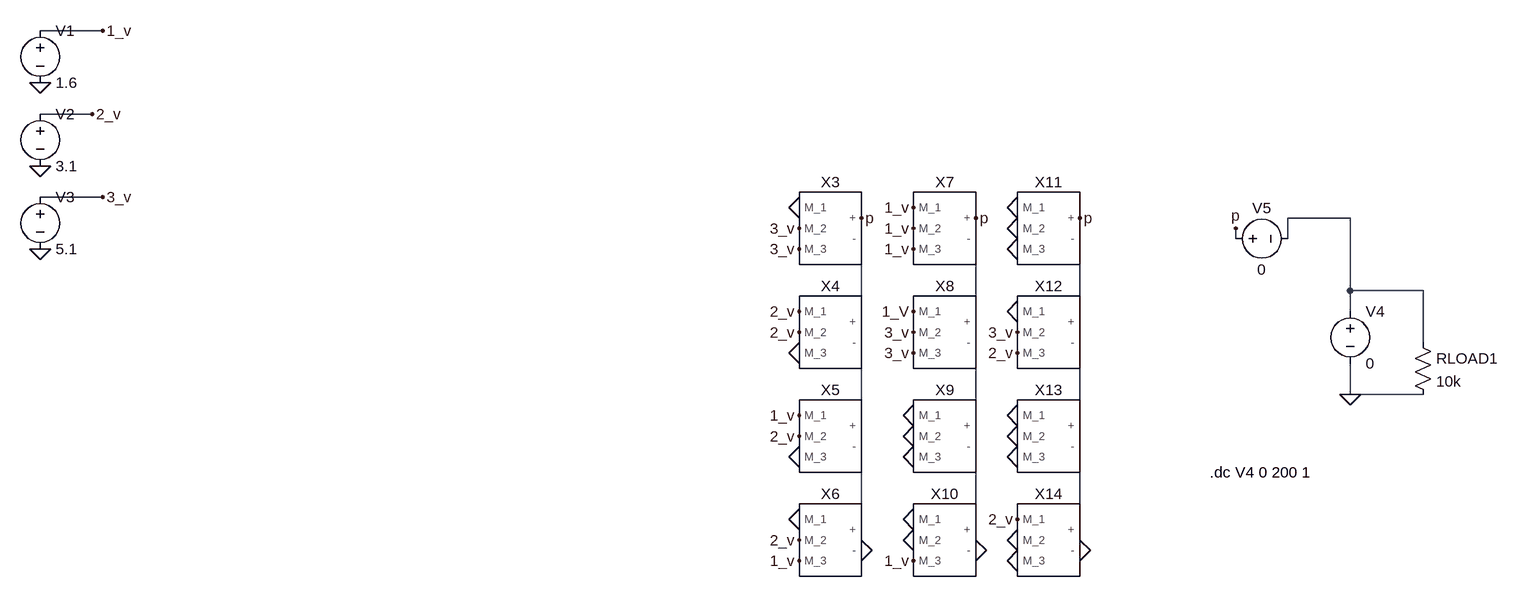
[diagram p0: schematic original.asc]
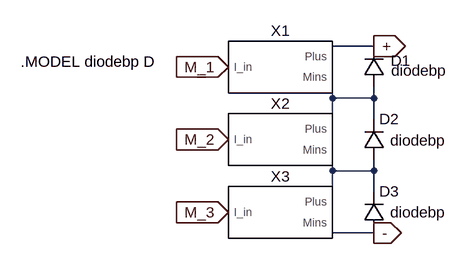
[diagram p1: sub-circuit pv_panel.asc]
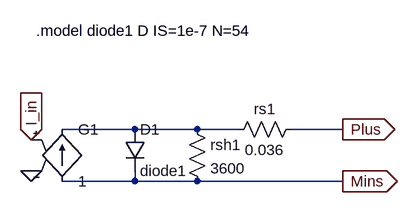
[diagram p2: sub-circuit module.asc]
original.asc, the LTspice schematic file:
Version 4
SHEET 1 1544 680
WIRE -608 -352 -704 -352
WIRE -624 -224 -704 -224
WIRE -608 -96 -704 -96
WIRE 1312 -64 1216 -64
WIRE 1136 -32 1136 -48
WIRE 1216 -32 1216 -64
WIRE 1312 48 1312 -64
WIRE 1424 48 1312 48
WIRE 1312 80 1312 48
WIRE 560 96 560 -32
WIRE 736 96 736 -32
WIRE 896 96 896 -32
WIRE 1424 128 1424 48
WIRE 1312 208 1312 160
WIRE 1424 208 1312 208
WIRE 560 256 560 128
WIRE 736 256 736 128
WIRE 896 256 896 128
WIRE 560 416 560 288
WIRE 736 416 736 288
WIRE 896 416 896 288
FLAG -704 -272 0
FLAG -704 -144 0
FLAG -704 -16 0
FLAG -608 -352 1_v
FLAG -624 -224 2_v
FLAG -608 -96 3_v
FLAG 896 448 0
FLAG 736 448 0
FLAG 560 448 0
FLAG 464 -48 3_v
FLAG 464 -16 3_v
FLAG 640 112 3_v
FLAG 640 144 3_v
FLAG 800 112 3_v
FLAG 640 -80 1_v
FLAG 640 -48 1_v
FLAG 640 -16 1_v
FLAG 464 240 1_v
FLAG 464 464 1_v
FLAG 640 464 1_v
FLAG 464 80 2_v
FLAG 464 112 2_v
FLAG 464 272 2_v
FLAG 464 432 2_v
FLAG 800 400 2_v
FLAG 800 144 2_v
FLAG 464 304 0
FLAG 464 144 0
FLAG 464 -80 0
FLAG 800 -80 0
FLAG 800 -48 0
FLAG 800 -16 0
FLAG 800 80 0
FLAG 800 240 0
FLAG 800 272 0
FLAG 800 304 0
FLAG 800 432 0
FLAG 800 464 0
FLAG 640 432 0
FLAG 640 400 0
FLAG 640 304 0
FLAG 640 272 0
FLAG 640 240 0
FLAG 896 -64 p
FLAG 736 -64 p
FLAG 560 -64 p
FLAG 464 400 0
FLAG 640 80 1_V
FLAG 1312 208 0
FLAG 1136 -48 p
SYMBOL voltage -704 -368 R0
SYMATTR InstName V1
SYMATTR Value 1.6
SYMBOL voltage -704 -240 R0
SYMATTR InstName V2
SYMATTR Value 3.1
SYMBOL voltage -704 -112 R0
SYMATTR InstName V3
SYMATTR Value 5.1
SYMBOL PV_panel 512 -48 R0
SYMATTR InstName X3
SYMBOL PV_panel 512 112 R0
SYMATTR InstName X4
SYMBOL PV_panel 512 272 R0
SYMATTR InstName X5
SYMBOL PV_panel 512 432 R0
SYMATTR InstName X6
SYMBOL PV_panel 688 -48 R0
SYMATTR InstName X7
SYMBOL PV_panel 688 112 R0
SYMATTR InstName X8
SYMBOL PV_panel 688 272 R0
SYMATTR InstName X9
SYMBOL PV_panel 688 432 R0
SYMATTR InstName X10
SYMBOL PV_panel 848 -48 R0
SYMATTR InstName X11
SYMBOL PV_panel 848 112 R0
SYMATTR InstName X12
SYMBOL PV_panel 848 272 R0
SYMATTR InstName X13
SYMBOL PV_panel 848 432 R0
SYMATTR InstName X14
SYMBOL voltage 1312 64 R0
SYMATTR InstName V4
SYMATTR Value 0
SYMBOL voltage 1120 -32 R270
WINDOW 0 32 56 VTop 2
WINDOW 3 -32 56 VBottom 2
SYMATTR InstName V5
SYMATTR Value 0
SYMBOL res 1408 112 R0
SYMATTR InstName RLOAD1
SYMATTR Value 10k
TEXT 1096 328 Left 2 !.dc V4 0 200 1

pv_panel.asc, the sub-circuit schematic file:
Version 4
SHEET 1 880 680
WIRE 352 96 288 96
WIRE 288 112 288 96
WIRE 288 176 288 144
WIRE 352 176 352 160
WIRE 352 176 288 176
WIRE 352 208 352 176
WIRE 288 224 288 176
WIRE 288 288 288 256
WIRE 352 288 352 272
WIRE 352 288 288 288
WIRE 352 320 352 288
WIRE 288 336 288 288
WIRE 288 384 288 368
WIRE 352 384 288 384
FLAG 128 128 M_1
IOPIN 128 128 In
FLAG 128 240 M_2
IOPIN 128 240 In
FLAG 128 352 M_3
IOPIN 128 352 In
FLAG 352 96 +
IOPIN 352 96 Out
FLAG 352 384 -
IOPIN 352 384 Out
SYMBOL module 208 128 R0
SYMATTR InstName X1
SYMBOL module 208 240 R0
SYMATTR InstName X2
SYMBOL module 208 352 R0
SYMATTR InstName X3
SYMBOL diode 336 160 M180
WINDOW 0 42 42 Left 2
WINDOW 3 43 26 Left 2
SYMATTR InstName D1
SYMATTR Value diodebp
SYMBOL diode 336 272 M180
WINDOW 0 24 64 Left 2
WINDOW 3 41 31 Left 2
SYMATTR InstName D2
SYMATTR Value diodebp
SYMBOL diode 336 384 M180
WINDOW 0 24 64 Left 2
WINDOW 3 41 32 Left 2
SYMATTR InstName D3
SYMATTR Value diodebp
TEXT -192 120 Left 2 !.MODEL diodebp D

module.asc, the sub-circuit schematic file:
Version 4
SHEET 1 880 680
WIRE 128 64 16 64
WIRE 224 64 128 64
WIRE 288 64 224 64
WIRE 448 64 368 64
WIRE 128 144 128 128
WIRE 128 144 16 144
WIRE 224 144 128 144
WIRE 448 144 224 144
FLAG -32 128 0
FLAG -32 80 I_in
IOPIN -32 80 In
FLAG 448 64 Plus
IOPIN 448 64 Out
FLAG 448 144 Mins
IOPIN 448 144 Out
SYMBOL diode 112 64 R0
SYMATTR InstName D1
SYMATTR Value diode1
SYMBOL res 208 48 R0
SYMATTR InstName rsh1
SYMATTR Value 3600
SYMBOL res 384 48 R90
WINDOW 0 0 56 VBottom 2
WINDOW 3 32 56 VTop 2
SYMATTR InstName rs1
SYMATTR Value 0.036
SYMBOL g 16 48 R0
SYMATTR InstName G1
SYMATTR Value 1
TEXT -24 -88 Left 2 !.model diode1 D IS=1e-7 N=54

The netlist it stands for:
* original.asc
V1 1_v 0 1.6
V2 2_v 0 3.1
V3 3_v 0 5.1
XX3 0 3_v 3_v p N002 pv_panel
XX4 2_v 2_v 0 N002 N005 pv_panel
XX5 1_v 2_v 0 N005 N008 pv_panel
XX6 0 2_v 1_v N008 0 pv_panel
XX7 1_v 1_v 1_v p N003 pv_panel
XX8 1_v 3_v 3_v N003 N006 pv_panel
XX9 0 0 0 N006 N009 pv_panel
XX10 0 0 1_v N009 0 pv_panel
XX11 0 0 0 p N004 pv_panel
XX12 0 3_v 2_v N004 N007 pv_panel
XX13 0 0 0 N007 N010 pv_panel
XX14 2_v 0 0 N010 0 pv_panel
V4 N001 0 0
V5 p N001 0
RLOAD1 N001 0 10k

* block symbol definitions
.subckt pv_panel M_1 M_2 M_3 + -
XX1 M_1 + N001 module
XX2 M_2 N001 N002 module
XX3 M_3 N002 - module
D1 N001 + diodebp
D2 N002 N001 diodebp
D3 - N002 diodebp
.MODEL diodebp D
.ends pv_panel

.subckt module I_in Plus Mins
D1 N001 Mins diode1
rsh1 N001 Mins 3600
rs1 Plus N001 0.036
G1 Mins N001 I_in 0 1
.model diode1 D IS=1e-7 N=54
.ends module

.model D D
.lib standard.dio
.dc V4 0 200 1
.backanno
.end

* Results of the author's LTspice run, read from the files saved beside the schematic
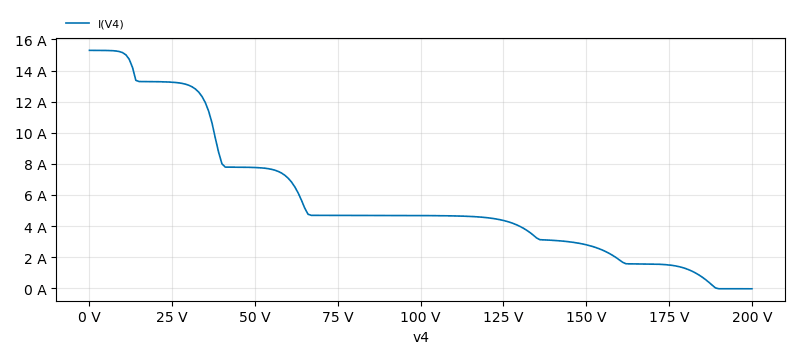
[diagram p3: DC transfer characteristic of original.asc, plotted from the saved traces]
* DC transfer characteristic, 1 run:
*   I(V4): 15.29 A at v4=0 V, -28.84 mA at v4=200 V, min -28.84 mA, max 15.29 A